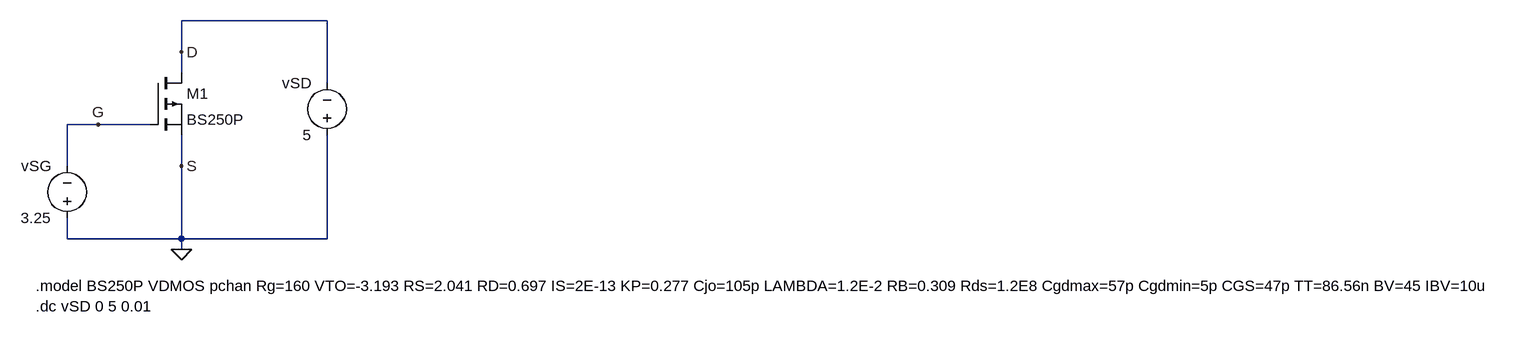
[diagram p0: schematic Lab9p2.asc]
Lab9p2.asc, the LTspice schematic file:
Version 4
SHEET 1 2384 680
WIRE 416 -32 192 -32
WIRE 192 16 192 -32
WIRE 192 48 192 16
WIRE 416 64 416 -32
WIRE 64 128 16 128
WIRE 144 128 64 128
WIRE 16 192 16 128
WIRE 192 192 192 144
WIRE 16 304 16 272
WIRE 192 304 192 192
WIRE 192 304 16 304
WIRE 416 304 416 144
WIRE 416 304 192 304
WIRE 192 320 192 304
FLAG 192 192 S
FLAG 64 128 G
FLAG 192 16 D
FLAG 192 320 0
SYMBOL pmos 144 48 R0
SYMATTR InstName M1
SYMATTR Value BS250P
SYMBOL voltage 16 288 R180
WINDOW 0 24 96 Left 2
WINDOW 3 24 16 Left 2
WINDOW 123 0 0 Left 0
WINDOW 39 0 0 Left 0
SYMATTR InstName vSG
SYMATTR Value 3.25
SYMBOL voltage 416 160 R180
WINDOW 0 24 96 Left 2
WINDOW 3 24 16 Left 2
WINDOW 123 0 0 Left 0
WINDOW 39 0 0 Left 0
SYMATTR InstName vSD
SYMATTR Value 5
TEXT -32 376 Left 2 !.model BS250P VDMOS pchan Rg=160 VTO=-3.193 RS=2.041 RD=0.697 IS=2E-13 KP=0.277 Cjo=105p LAMBDA=1.2E-2 RB=0.309 Rds=1.2E8 Cgdmax=57p Cgdmin=5p CGS=47p TT=86.56n BV=45 IBV=10u
TEXT -32 408 Left 2 !.dc vSD 0 5 0.01

The netlist it stands for:
* Lab9p2.asc
M1 D G 0 0 BS250P
vSG 0 G 3.25
vSD 0 D 5
.model NMOS NMOS
.model PMOS PMOS
.lib standard.mos
.model BS250P VDMOS pchan Rg=160 VTO=-3.193 RS=2.041 RD=0.697 IS=2E-13 KP=0.277 Cjo=105p LAMBDA=1.2E-2 RB=0.309 Rds=1.2E8 Cgdmax=57p Cgdmin=5p CGS=47p TT=86.56n BV=45 IBV=10u
.dc vSD 0 5 0.01
.backanno
.end

* Results of the author's LTspice run, read from the files saved beside the schematic
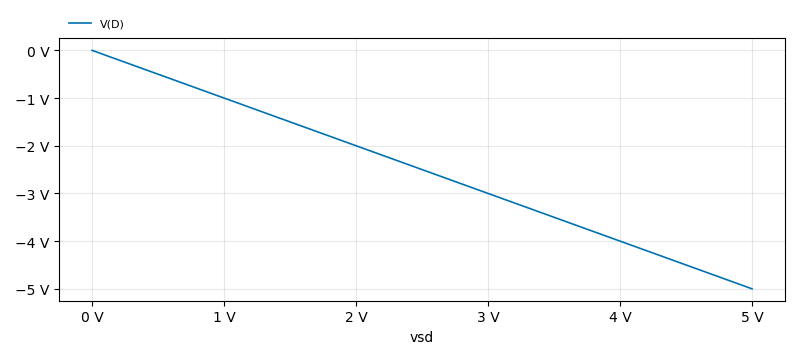
[diagram p1: DC transfer characteristic of Lab9p2.asc, plotted from the saved traces]
* DC transfer characteristic, 1 run:
*   V(D): 0 V at vsd=0 V, -5 V at vsd=5 V, min -5 V, max 0 V